# Altium schematic sheet 03_Ethernet.SchDoc
size A4; SheetNumber: 3; SheetTotal: 5
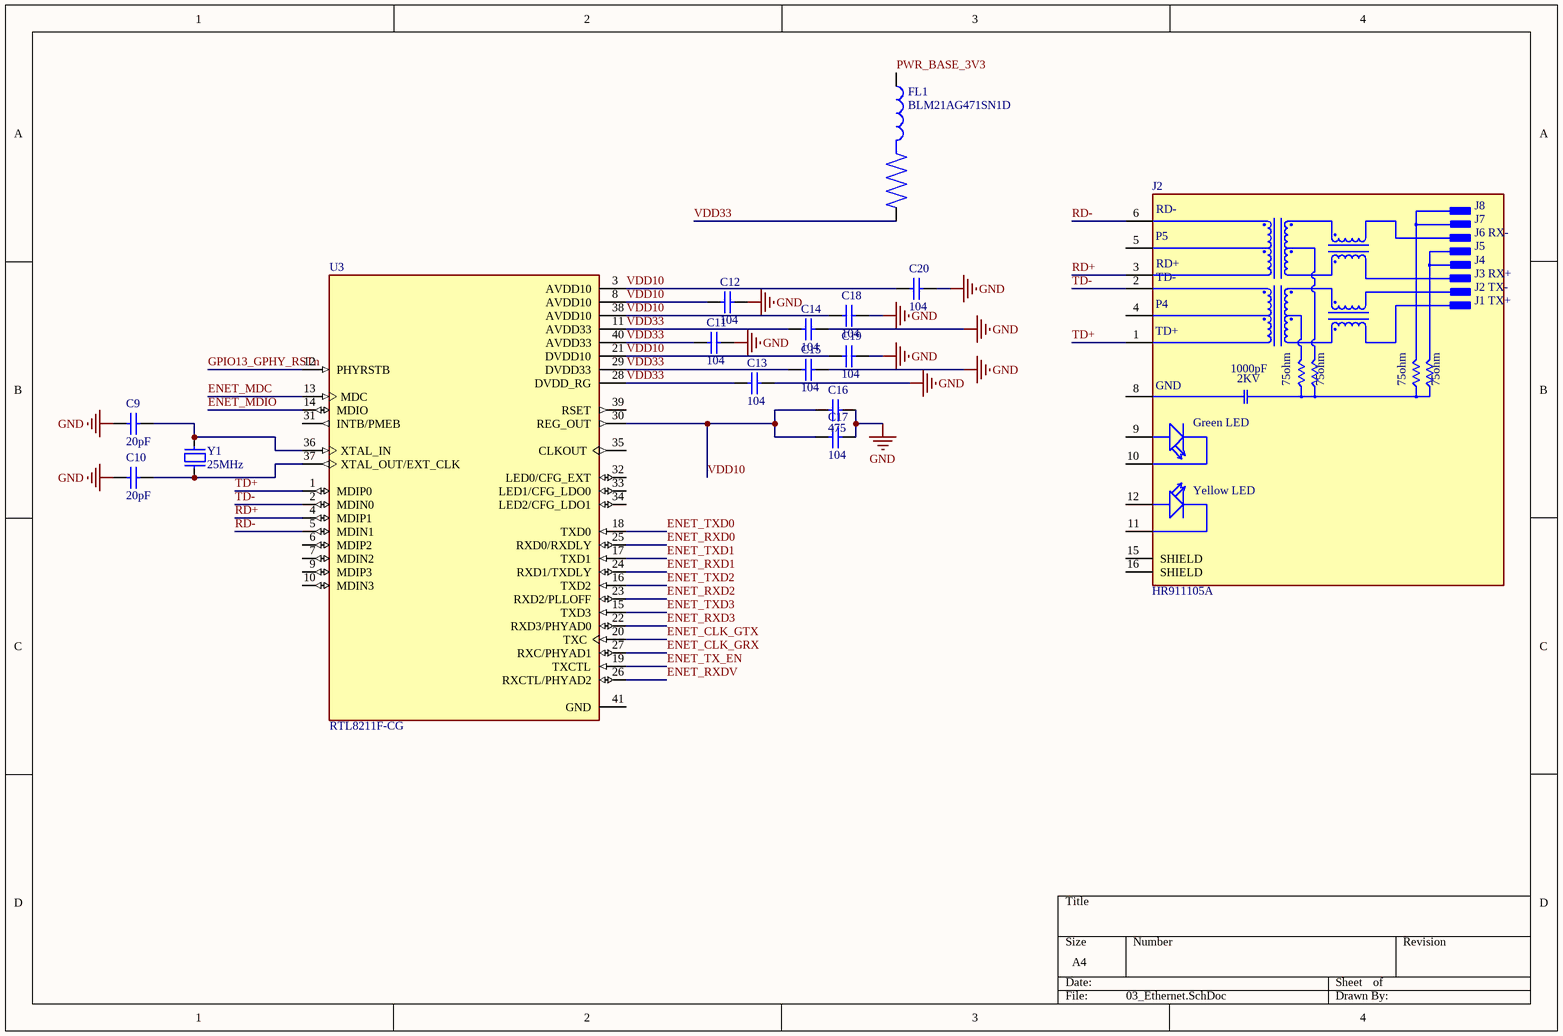
[diagram p0: 03_Ethernet.SchDoc]

## Parts
C9  20pF  [tu 0805]
C10  20pF  [tu 0805]
C11  104  [tu 1206]
C12  104  [tu 1206]
C13  104  [tu 1206]
C14  104  [tu 1206]
C15  104  [tu 1206]
C16  475  [tu 0805]
C17  104  [tu 1206]
C18  104  [tu 1206]
C19  104  [tu 1206]
C20  104  [tu 1206]
FL1  BLM21AG471SN1D  [BEADC2012X105N]
J2  HR911105A  [HANRUN_HR911105A]
U3  RTL8211F-CG  [QFN40P500X500X90-41N]
Y1  25MHz  [Thach Anh 2 Chan 32,768 KHz]

## Nets
GND: C9.1 C10.1 C11.1 C12.1 C13.1 C14.1 C15.1 C16.1 C17.1 C18.1 C19.1 C20.1
ENET_CLK_GRX: U3.27(RXC/PHYAD1)
ENET_CLK_GTX: U3.20(TXC)
ENET_MDC: U3.13(MDC)
ENET_MDIO: U3.14(MDIO)
ENET_RXD0: U3.25(RXD0/RXDLY)
ENET_RXD1: U3.24(RXD1/TXDLY)
ENET_RXD2: U3.23(RXD2/PLLOFF)
ENET_RXD3: U3.22(RXD3/PHYAD0)
ENET_RXDV: U3.26(RXCTL/PHYAD2)
ENET_TX_EN: U3.19(TXCTL)
ENET_TXD0: U3.18(TXD0)
ENET_TXD1: U3.17(TXD1)
ENET_TXD2: U3.16(TXD2)
ENET_TXD3: U3.15(TXD3)
GPIO13_GPHY_RSTn: U3.12(PHYRSTB)
PWR_BASE_3V3: FL1.1
RD+: J2.3(RD+) U3.4(MDIP1)
RD-: J2.6(RD-) U3.5(MDIN1)
TD+: J2.1(TD+) U3.1(MDIP0)
TD-: J2.2(TD-) U3.2(MDIN0)
VDD10: C12.2 C16.2 C17.2 C18.2 C19.2 C20.2 U3.3(AVDD10) U3.8(AVDD10) U3.21(DVDD10) U3.30(REG_OUT) U3.38(AVDD10)
VDD33: C11.2 C13.2 C14.2 C15.2 FL1.2 U3.11(AVDD33) U3.28(DVDD_RG) U3.29(DVDD33) U3.40(AVDD33)
NetC9_2: C9.2 U3.36(XTAL_IN) Y1.2
NetC10_2: C10.2 U3.37(XTAL_OUT/EXT_CLK) Y1.1

Not connected (* = marked no-connect by the designer): J2 4(P4) 5(P5) 8(GND) 9(GA) 10(GC) 11(YC) 12(YA) 15(SHIELD) 16(SHIELD); U3 6(MDIP2) 7(MDIN2) 9(MDIP3) 10(MDIN3) 31(INTB/PMEB) 32(LED0/CFG_EXT) 33(LED1/CFG_LDO0) 34(LED2/CFG_LDO1) 35(CLKOUT) 39(RSET) 41(GND)

## Notes on the sheet
- (in symbol HR911105A) J8; J7; J6 RX-; J5; J4; J3 RX+; J2 TX-; J1 TX+; 1000pF; 2KV; 75ohm; Green LED; Yellow LED

## Library data of the parts
C9 C10 = Tu 0805 20pF 50V 10%: Dán; Don_Vi: Con; Ten_Linh_Kien: Tụ 0805 20P 10% 50V; So_Chan: 2; Ma_Hang: MH004558; Chung_Loai: Dán; Kieu_Chan: *
C11-C15 C17-C20 = Tu 1206 104 50V 20%: Dán; Don_Vi: Con; So_Chan: 2; Ten_Linh_Kien: Tụ 1206 104-0.1uF 20% 50V; Ma_Hang: MH004544; Chung_Loai: Dán; Kieu_Chan: *
C16 = Tu 0805 475 25V 20%: Dán; Don_Vi: Con; So_Chan: 2; Ten_Linh_Kien: Tụ 0805 475-4.7uF 20% 25V; Ma_Hang: MH004276; Chung_Loai: Dán; Kieu_Chan: *
FL1 = BLM21AG471SN1D: 470 Ohms @ 100MHz 1 Ferrite Bead 0805 _2012 Metric_ 700mA 190mOhm; MF: Murata Electronics; Value: *; Package: 2012 Murata; MP: BLM21AG471SN1D; Price: None; SnapEDA_Link: https://www.snapeda.com/parts/BLM21AG471SN1D/Murata/view-part/291265/?ref=snap; Availability: Unavailable
J2 = HR911105A: DIP RJ45 Connector;; MF: hanrun; SnapEDA_Link: https://www.snapeda.com/parts/HR911105A/HanRun/view-part/?ref=snap; Package: None; MP: HR911105A; Check_prices: https://www.snapeda.com/parts/HR911105A/HanRun/view-part/?ref=eda; Price: None; Value: *; Availability: Not in stock
U3 = RTL8211F-CG: GbE PHY with RGMIII interface & EEE feature (Switch Regulator), QFN40; MF: Realtek Semiconductor Corp; SnapEDA_Link: https://www.snapeda.com/parts/RTL8211F-CG/Realtek/view-part/?ref=snap; Package: None; Value: *; MP: RTL8211F-CG; Check_prices: https://www.snapeda.com/parts/RTL8211F-CG/Realtek/view-part/?ref=eda
Y1 = Thach Anh 2 chan 32,768 Khz: Crystal For all Crystal 2pin.; Value: 4Mhz